# Altium schematic sheet motor_controller.SchDoc
size A4
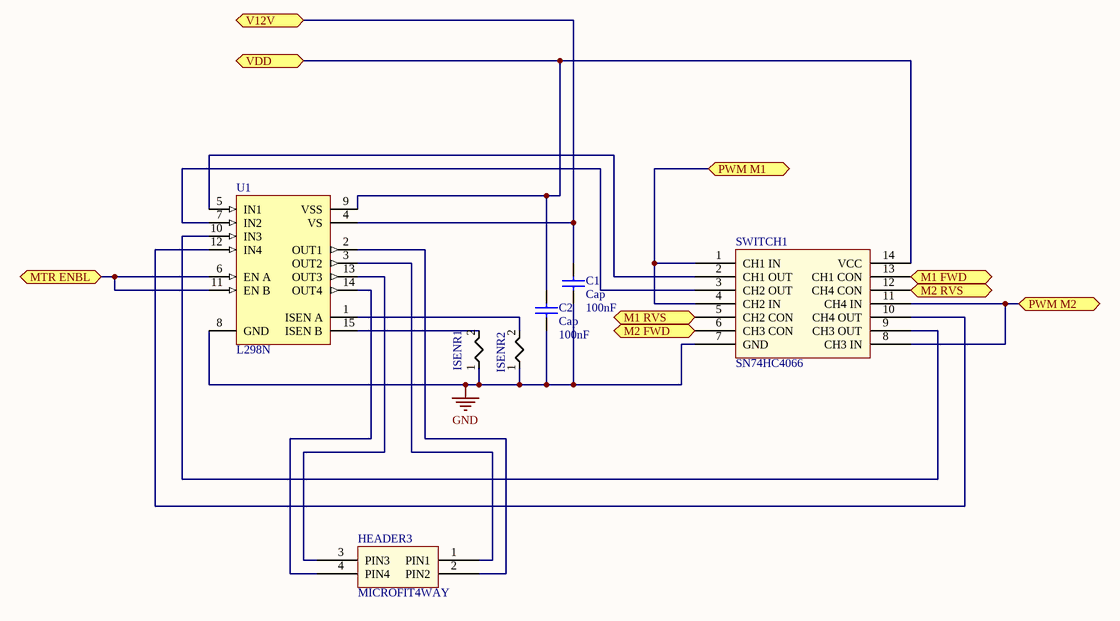
[diagram p0: motor_controller.SchDoc]

## Parts
C1  Cap  value 100nF  [RAD-0.3]
C2  Cap  value 100nF  [RAD-0.3]
HEADER3  MICROFIT4WAY  [MULTIFIT-4WAY]
ISENR1  CURRENT SENSE RESISTOR  [CURRENT_SENSE_RESISTOR]  (value not drawn)
ISENR2  CURRENT SENSE RESISTOR  [CURRENT_SENSE_RESISTOR]  (value not drawn)
SWITCH1  SN74HC4066  [SN74HC4066_DIP]
U1  L298N  [Multiwatt15V]

## Ports
M1 FWD, M1 RVS, M2 FWD, M2 RVS, MTR ENBL, PWM M1, PWM M2, V12V, VDD

## Nets
GND: C1.1 C2.1 ISENR1.1(PIN1) ISENR2.1(PIN1) SWITCH1.7(GND) U1.8(GND)
M1 FWD: SWITCH1.13(CH1_CON) ; port M1 FWD
M1 RVS: SWITCH1.5(CH2_CON) ; port M1 RVS
M2 FWD: SWITCH1.6(CH3_CON) ; port M2 FWD
M2 RVS: SWITCH1.12(CH4_CON) ; port M2 RVS
MTR ENBL: U1.6(EN_A) U1.11(EN_B) ; port MTR ENBL
PWM M1: SWITCH1.1(CH1_IN) SWITCH1.4(CH2_IN) ; port PWM M1
PWM M2: SWITCH1.8(CH3_IN) SWITCH1.11(CH4_IN) ; port PWM M2
V12V: C1.2 U1.4(VS) ; port V12V
VDD: C2.2 SWITCH1.14(VCC) U1.9(VSS) ; port VDD
NetHEADER3_1: HEADER3.1(PIN1) U1.3(OUT2)
NetHEADER3_2: HEADER3.2(PIN2) U1.2(OUT1)
NetHEADER3_3: HEADER3.3(PIN3) U1.13(OUT3)
NetHEADER3_4: HEADER3.4(PIN4) U1.14(OUT4)
NetISENR1_2: ISENR1.2(PIN2) U1.15(ISEN_B)
NetISENR2_2: ISENR2.2(PIN2) U1.1(ISEN_A)
NetSWITCH1_2: SWITCH1.2(CH1_OUT) U1.5(IN1)
NetSWITCH1_3: SWITCH1.3(CH2_OUT) U1.7(IN2)
NetSWITCH1_9: SWITCH1.9(CH3_OUT) U1.10(IN3)
NetSWITCH1_10: SWITCH1.10(CH4_OUT) U1.12(IN4)

## Library data of the parts
C1 C2 = Cap: Capacitor; Published: 8-Jun-2000; LatestRevisionDate: 17-Jul-2002; LatestRevisionNote: Re-released for DXP Platform.; PackageReference: RAD-0.3; Publisher: Altium Limited; PackageDescription: Radial Cap, Thru-Hole; 2 Leads; 0.3 in Pin Spacing
HEADER3 = MICROFIT4WAY HEADER
SWITCH1 = SN74HC4066 SWITCH
U1 = L298N: Dual Full Bridge Driver; Published: 8-Jun-2000; LatestRevisionDate: 14-May-2007; LatestRevisionNote: Mapped to vertical PCB.; DatasheetVersion: Jul-1999; PackageReference: Multiwatt15V; Publisher: Altium Limited; PackageDescription: TO, Thru-Hole, Vertical, Heatsink Mounted; 15 Bent Staggered Leads; Pitch 1.27 mm; ComponentLink1Description: Manufacturer Link; ComponentLink1URL: http://www.st.com/; ComponentLink2Description: Datasheet; ComponentLink2URL: http://www.st.com/stonline/products/literature/ds/1773/l298.pdf